# EAGLE design sensor (EAGLE 6.5.0)
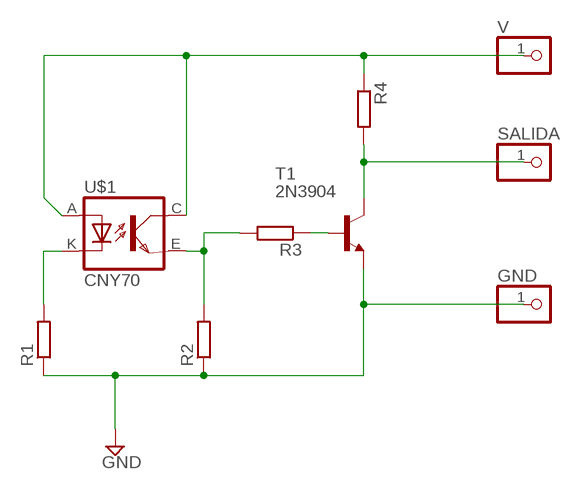
[diagram p0: schematic, sheet 1]

## Parts
GND  PINHD-1X1  [1X01]
R1  R-EU_0207/10  [0207/10]
R2  R-EU_0207/10  [0207/10]
R3  R-EU_0207/10  [0207/10]
R4  R-EU_0207/10  [0207/10]
SALIDA  PINHD-1X1  [1X01]
T1  2N3904  [TO92]
U$1  CNY70  [4]
V  PINHD-1X1  [1X01]

## Nets
GND: GND.1 R1.1 R2.1 T1.3(E)
N$1: R2.2 R3.2 U$1.E(EMI)
N$2: R1.2 U$1.K(C)
N$3: R3.1 T1.2(B)
N$4: R4.1 U$1.A U$1.C(COL) V.1
N$5: R4.2 SALIDA.1 T1.1(C)

## Library data of the parts
GND SALIDA V = pinhead:PINHD-1X1: PIN HEADER
R1-R4 = rcl:R-EU_: RESISTOR, European symbol
T1 = transistor:2N3904: NPN TRANSISTOR
U$1 = cny70:CNY70

## Board
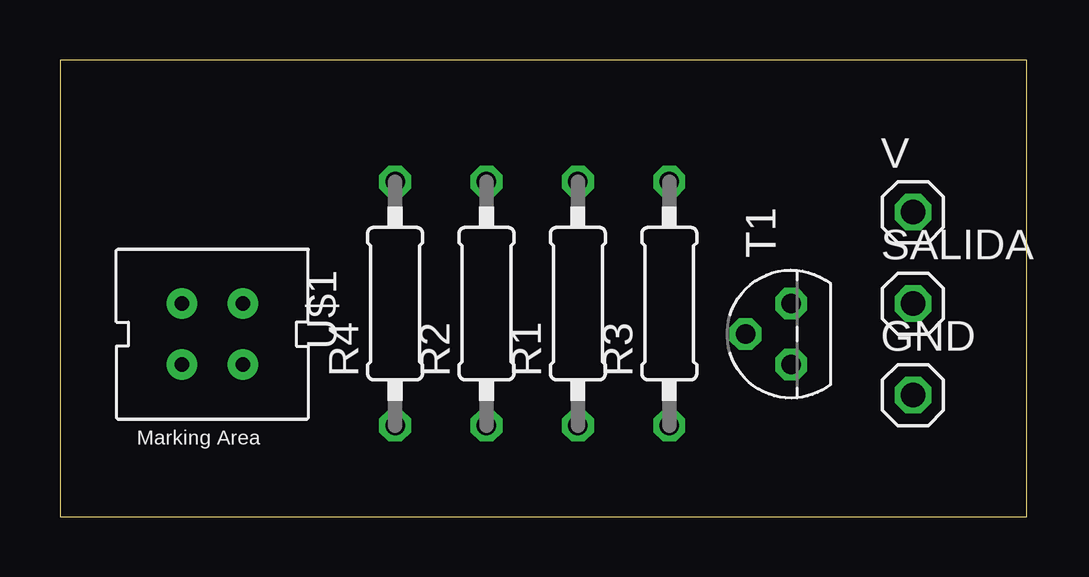
[diagram p1: board, top side]
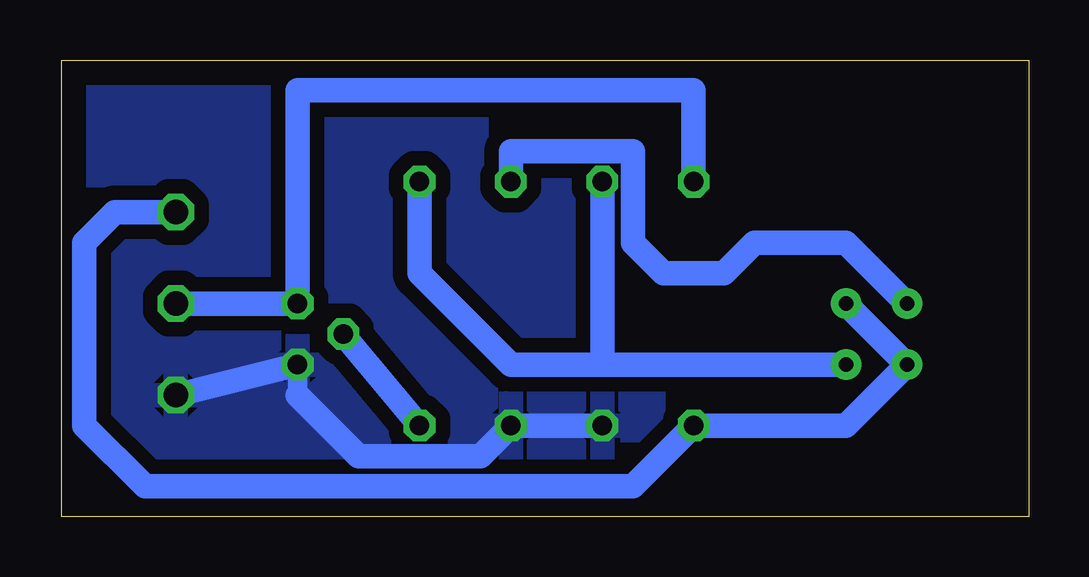
[diagram p2: board, bottom side, seen from below]

Size 40.31 x 19.04 mm. Coordinates in mm from the lower left corner, seen from the top.
Outline: 0,0 40.31,0 40.31,19.04 0,19.04 0,0
Copper layers (1*16): Top 0.035mm / dielectric 1.5mm / Bottom 0.035mm
Design rules "default": minimum track width 10mil, minimum drill 24mil, track to track 8mil, track to pad 8mil, pad to pad 8mil, via to via 8mil, smd to smd 8mil, copper to edge 40mil, drill to drill 8mil, minimum pad ring 10mil, minimum via ring 8mil, stop-mask expansion 4mil, vias tented up to drill 0mil, thermal gap 10mil

### Footprints (pad centres in the part's own frame; a part is rotated, then mirrored left to right if it is on the bottom)
1X01 = drill 1.016 octagon: 1 0,0
0207/10 = drill 0.813 octagon: 1 -5.08,0; 2 5.08,0
TO92 = drill 0.813 octagon: 1 1.27,0; 2 0,1.905; 3 -1.27,0
4 = drill 0.61 pad 1.27: A -1.27,1.27; C 1.27,-1.27; E 1.27,1.27; K -1.27,-1.27

### Placement (x,y rotation side)
GND  35.56,5.08 0 top
R1  21.59,8.89 90 top
R2  17.78,8.89 90 top
R3  25.4,8.89 90 top
R4  13.97,8.89 90 top
SALIDA  35.56,8.89 0 top
T1  30.48,7.62 90 top
U$1  6.35,7.62 270 top
V  35.56,12.7 0 top

### Tracks (layer width: path | path; a pad name or v marks a point on that pad's centre or on a via)
GND
  Bottom 0.813: 30.48,5.08 T1.3
  Bottom 1.016: R2.1 R1.1 22.86,2.54 27.94,2.54 30.48,5.08 | GND.1 T1.3
  pour Bottom (isolate 0.61): 0,19.05 40.64,19.05 40.64,0 0,0
N$1
  Bottom 1.016: U$1.E 17.78,6.35 | 17.78,6.35 R2.2 | R3.2 25.4,10.16 21.59,6.35 17.78,6.35
N$2
  Bottom 1.016: U$1.K 7.62,11.43 11.43,11.43 12.7,10.16 15.24,10.16 16.51,11.43 16.51,15.24 21.59,15.24 R1.2
N$3
  Bottom 1.016: T1.2 R3.1
N$4
  Bottom 1.016: V.1 38.1,12.7 39.37,11.43 39.37,3.81 36.83,1.27 16.51,1.27 R4.1 7.62,3.81 U$1.C U$1.A
N$5
  Bottom 1.016: SALIDA.1 T1.1 30.48,17.78 13.97,17.78 R4.2